# EAGLE design untitled (EAGLE 9.4.0)
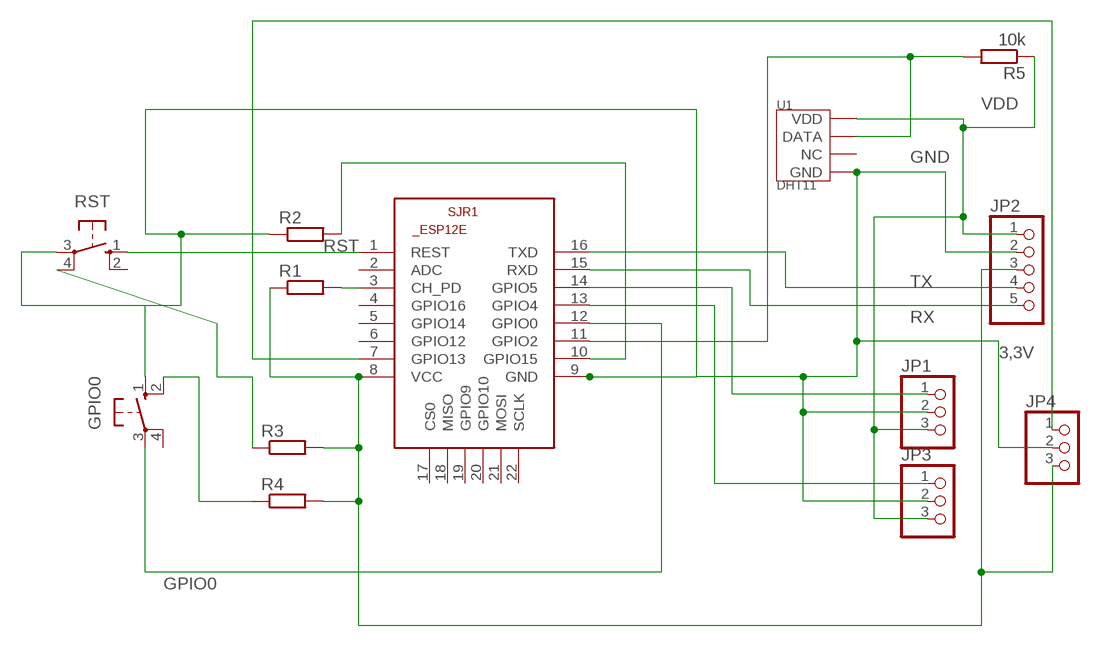
[diagram p0: schematic, sheet 1]

## Parts
GPIO0  10-XX  [B3F-10XX]
JP1  PINHD-1X3  [1X03]
JP2  PINHD-1X5  [1X05]
JP3  PINHD-1X3  [1X03]
JP4  PINHD-1X3  [1X03]
R1  R-EU_0207/10  [0207/10]
R2  R-EU_0207/10  [0207/10]
R3  R-EU_0207/10  [0207/10]
R4  R-EU_0207/10  [0207/10]
R5  10k  R-EU_0207/10  [0207/10]
RST  10-XX  [B3F-10XX]
SJR1  ESP8266-12EESP12E  [ESP8266-ESP12E]
U1  DHT11  TEM-HUM-DHT11(4P-15.5X12.0MM)  [SNR4-2.54-15.5X12.0X5.5MM]

## Nets
3,3V: JP2.3 JP4.3 R1.1 R3.2 R4.2 SJR1.8(VCC)
GND: GPIO0.1(S) JP1.2 JP2.2 JP3.2 JP4.2 R2.1 RST.3(P) SJR1.9(GND) U1.4(GND)
GPIO0: GPIO0.3(P) SJR1.12(GPIO0)
N$1: R5.2 SJR1.11(GPIO2) U1.2(DATA)
N$2: R3.1 RST.4(P1)
N$3: R1.2 SJR1.3(CH_PD)
N$4: R2.2 SJR1.10(GPIO15)
N$5: JP1.1 SJR1.14(GPIO5)
N$6: JP3.1 SJR1.13(GPIO4)
N$8: JP4.1 SJR1.7(GPIO13)
N$9: GPIO0.2(S1) R4.1
RST: RST.1(S) SJR1.1(REST)
RX: JP2.5 SJR1.15(RXD)
TX: JP2.4 SJR1.16(TXD)
VDD: JP1.3 JP2.1 JP3.3 R5.1 U1.1(VDD)
Unconnected: GPIO0.4(P1) RST.2(S1) SJR1.2(ADC) SJR1.4(GPIO16) SJR1.5(GPIO14) SJR1.6(GPIO12) SJR1.17(CS0) SJR1.18(MISO) SJR1.19(GPIO9) SJR1.20(GPIO10) SJR1.21(MOSI) SJR1.22(SCLK) U1.3(NC)

## Library data of the parts
GPIO0 RST = DC_LOAD_AU:10-XX: OMRON SWITCH; MPN: B3F-1000; OC_FARNELL: 176432; OC_NEWARK: 36M3542
JP1 JP3 JP4 = adafruit:PINHD-1X3: PIN HEADER
JP2 = pinhead:PINHD-1X5: PIN HEADER
R1-R5 = resistor:R-EU_: RESISTOR, European symbol
SJR1 = esp12e:ESP8266-12E: ESP8266-12E Library for Eagle CAD The author not responsible for any damages or errors!. Created by Suhail jr.lt;/author>
U1 = OPL_Sensor-Transducer:TEM-HUM-DHT11(4P-15.5X12.0MM): 314010000; MPN: DHT11

## Board
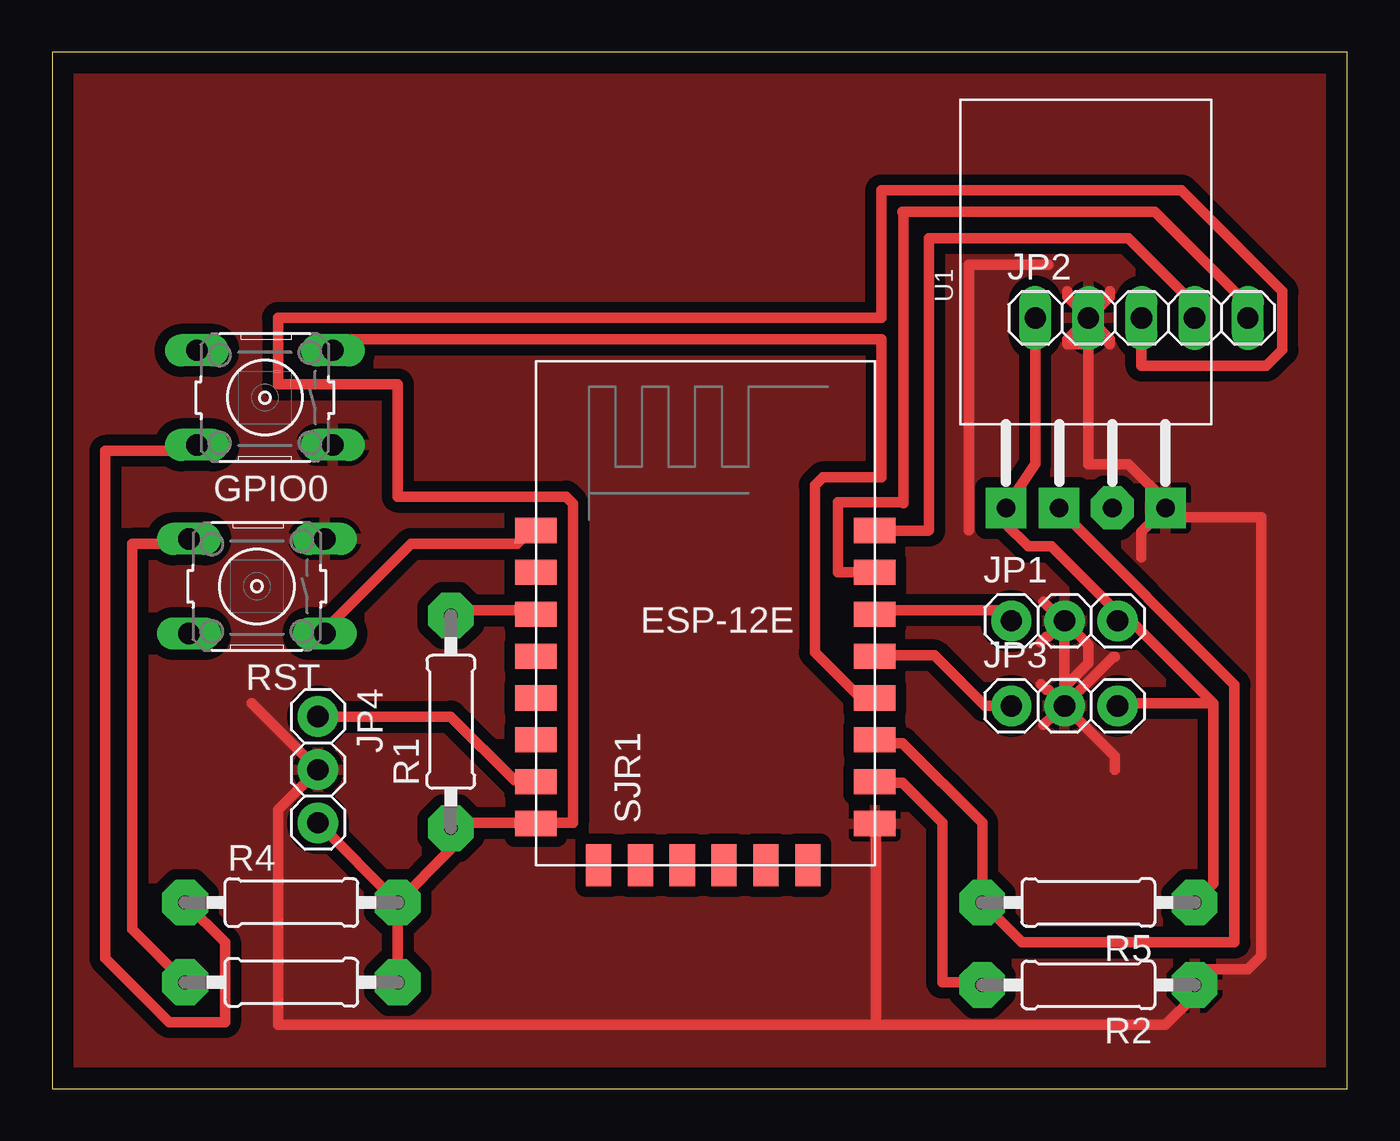
[diagram p1: board, top side]

Size 61.9 x 49.52 mm. Coordinates in mm from the lower left corner, seen from the top.
Outline: 0,0 61.9,0 61.9,49.52 0,49.52 0,0
Copper layers (1*16): Top 0.035mm / dielectric 1.5mm / Bottom 0.035mm
Design rules "default *": minimum track width 20mil, minimum drill 0.35mm, track to track 20mil, track to pad 20mil, pad to pad 6mil, via to via 6mil, smd to smd 6mil, copper to edge 40mil, drill to drill 6mil, minimum pad ring 10mil, minimum via ring 8mil, stop-mask expansion 4mil, vias tented up to drill 0mil, thermal gap 10mil

### Footprints (pad centres in the part's own frame; a part is rotated, then mirrored left to right if it is on the bottom)
B3F-10XX = drill 1.016 long: 1 -3.251,2.261; 2 3.251,2.261; 3 -3.251,-2.261; 4 3.251,-2.261
1X03 = drill 1.016 pad 1.93: 1 -2.54,0; 2 0,0; 3 2.54,0
1X05 = drill 1.016 long: 1 -5.08,0; 2 -2.54,0; 3 0,0; 4 2.54,0; 5 5.08,0
0207/10 = drill 0.65 pad 2.184 octagon: 1 -5.08,0; 2 5.08,0
ESP8266-ESP12E = smd 2 x 1.2: 1 -7.62,5.84; 2 -7.62,3.84; 3 -7.62,1.84; 4 -7.62,-0.16; 5 -7.62,-2.16; 6 -7.62,-4.16; 7 -7.62,-6.16; 8 -7.62,-8.16; 9 8.58,-8.16; 10 8.58,-6.16; 11 8.58,-4.16; 12 8.58,-2.16; 13 8.58,-0.16; 14 8.58,1.84; 15 8.58,3.84; 16 8.58,5.84 | smd 1.2 x 2: 17 -4.62,-10.16; 18 -2.62,-10.16; 19 -0.62,-10.16; 20 1.38,-10.16; 21 3.38,-10.16; 22 5.38,-10.16
SNR4-2.54-15.5X12.0X5.5MM = drill 0.889 pad 1.93 square: 1 -11.75,3.81; 2 -11.75,1.27; 4 -11.75,-3.81 | drill 0.889 pad 2.057 octagon: 3 -11.75,-1.27

### Placement (x,y rotation side)
GPIO0  10.16,33.02 180 top
JP1  48.39,22.35 0 top
JP2  52.07,36.83 0 top
JP3  48.39,18.29 0 top
JP4  12.7,15.24 270 top
R1  19.05,17.53 90 top
R2  49.53,4.95 180 top
R3  11.43,5.08 0 top
R4  11.43,8.89 0 top
R5  49.53,8.89 180 top
RST  9.78,24 180 top
SJR1  30.73,20.83 0 top
U1  49.4,39.5 90 top

### Tracks (layer width: path | path; a pad name or v marks a point on that pad's centre or on a via)
3,3V
  Top 0.508: R4.2 R3.2 | R4.2 JP4.3 | JP2.3 52.07,34.54 58.04,34.54 58.8,35.31 58.8,38.1 53.98,42.93 39.62,42.93 39.62,36.83 10.79,36.83 10.79,33.66 16.51,33.66 16.51,28.28 24.55,28.28 24.89,27.94 24.89,12.7 23.5,12.7 SJR1.8 22.86,12.7 19.05,12.7 R1.1 19.05,11.43 R4.2
GND
  Top 0.508: 9.53,18.41 JP4.2 10.79,13.34 10.79,3.05 39.37,3.05 | 39.37,3.05 39.37,12.7 SJR1.9 | 39.37,3.05 53.21,3.05 54.61,4.45 R2.1 54.61,5.08 55.24,5.71 57.15,5.71 57.78,6.35 57.78,27.3 53.34,27.3 U1.4 | U1.4 53.34,27.94 51.44,29.84 49.53,29.84 49.53,35.56 48.51,35.56 48.51,35.81 JP2.2 | 43.81,26.67 43.81,39.37 47.62,39.37 | JP2.2 49.53,37.47 49.91,37.85 50.55,37.85 | JP1.2 JP3.2 | JP2.2 50.55,35.81 50.55,35.56 49.53,36.58 JP2.2 | JP2.2 48.51,37.85 48.51,38.1 | JP2.2 50.55,37.85 | 50.55,37.85 50.55,38.1 | U1.4 52.07,26.6 52.07,25.4 | JP3.2 48.39,19.18 49.53,20.32 49.53,21.21 JP1.2 | JP3.2 47.88,17.78 47.78,17.78 47.39,17.38 | JP3.2 50.8,15.88 50.8,15.24 | JP3.2 50.72,20.62 50.8,20.62 | JP3.2 47.62,19.05 47.53,19.05 47.26,19.32 | JP1.2 48.29,22.35 47.39,23.26 | JP1.2 47.62,21.59 47.53,21.59 47.26,21.32
  pour Top: 0,0 0,49.53 62.23,49.53 62.23,0
GPIO0
  Top 0.508: GPIO0.3 13.41,35.56 13.57,35.81 39.62,35.81 39.62,29.21 36.83,29.21 36.45,28.83 36.45,20.86 38.63,18.67 38.55,18.67 SJR1.12
N$1
  Top 0.508: SJR1.11 39.37,16.51 40.64,16.51 44.45,12.7 R5.2 46.35,6.99 56.52,6.99 56.52,19.3 48.16,27.66 U1.2
N$2
  Top 0.508: R3.1 3.81,7.62 3.81,26.04 6.35,26.04 RST.4
N$3
  Top 0.508: SJR1.3 22.86,22.86 19.05,22.86 R1.2
N$4
  Top 0.508: SJR1.10 39.37,14.61 40.64,14.61 42.55,12.7 42.55,5.08 44.45,5.08 R2.2
N$5
  Top 0.508: SJR1.14 39.37,22.86 45.72,22.86 JP1.1
N$6
  Top 0.508: SJR1.13 39.35,20.7 42.16,20.7 44.58,18.29 JP3.1
N$8
  Top 0.508: JP4.1 19.05,17.78 22.1,14.73 23.09,14.73 SJR1.7
N$9
  Top 0.508: GPIO0.2 6.35,30.48 2.54,30.48 2.54,6.22 5.59,3.17 8.26,3.17 8.26,6.99 R4.1
RST
  Top 0.508: SJR1.1 22.86,26.67 22.23,26.04 17.14,26.04 13.34,22.23 RST.1
RX
  Top 0.508: JP2.5 57.15,37.47 52.7,41.91 40.64,41.91 40.68,41.87 40.68,27.98 40.63,28.03 37.55,28.03 37.55,24.67 SJR1.15
TX
  Top 0.508: JP2.4 54.61,37.47 51.44,40.64 41.91,40.64 41.91,26.67 41.85,26.67 SJR1.16
VDD
  Top 0.508: JP2.1 46.99,29.87 U1.1 45.59,26.96 46.65,25.91 47.75,25.91 50.93,22.73 JP1.3 51.56,22.35 55.5,18.41 | 55.5,18.41 51.05,18.41 JP3.3 | R5.1 55.5,9.78 55.5,18.41